# EAGLE design ml_controler (EAGLE 7.2.0)
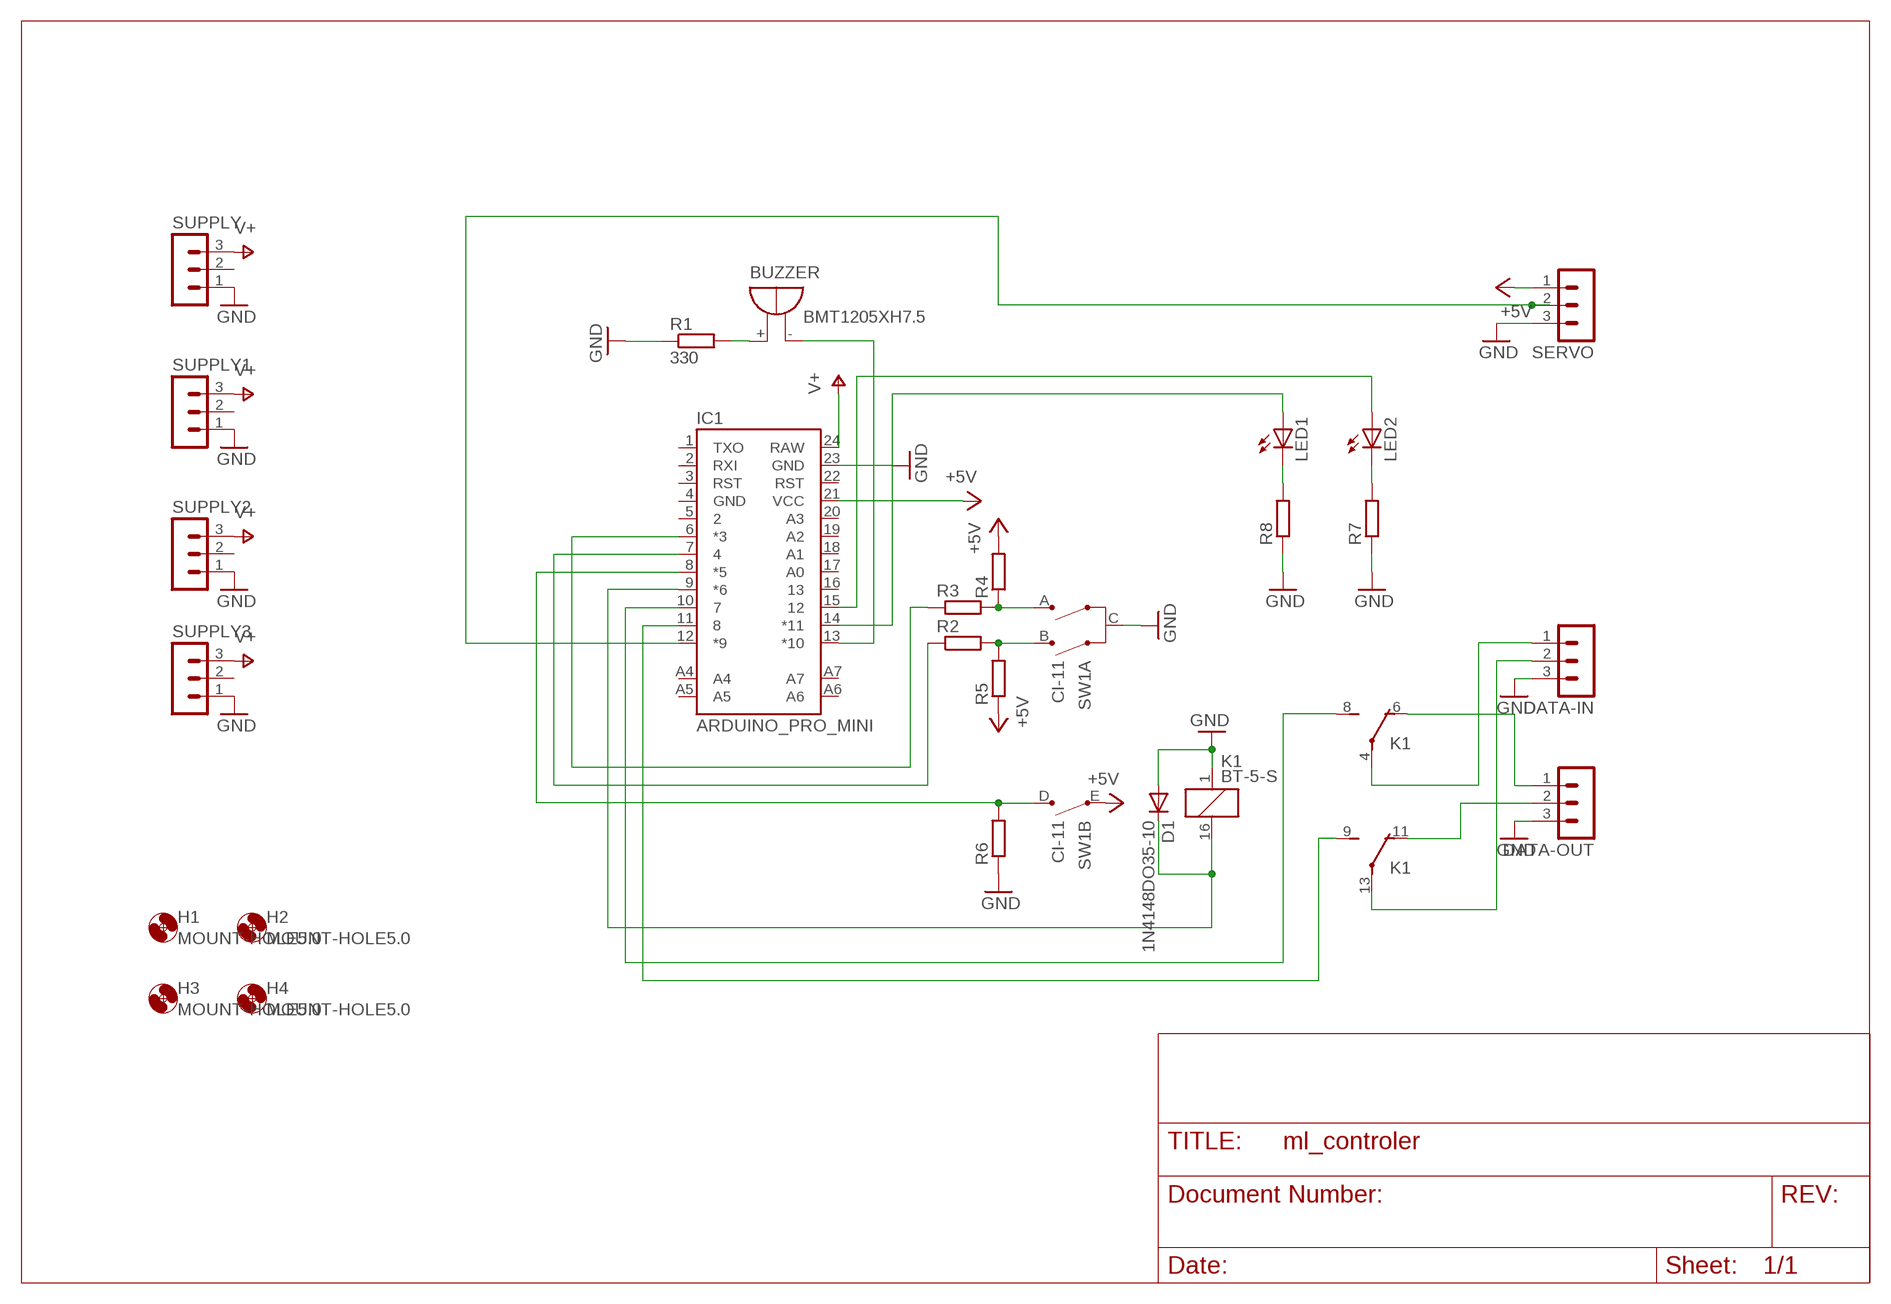
[diagram p0: schematic, sheet 1]

## Parts
BUZZER  BMT1205XH7.5  [BMT1205XH7.5]
D1  1N4148DO35-10  [DO35-10]
DATA-IN  MA03-1  [MA03-1]
DATA-OUT  MA03-1  [MA03-1]
H1  MOUNT-HOLE5.0  [5,0]
H2  MOUNT-HOLE5.0  [5,0]
H3  MOUNT-HOLE5.0  [5,0]
H4  MOUNT-HOLE5.0  [5,0]
IC1  ARDUINO_PRO_MINI  [ARDUINO_PRO_MINI]
K1  BT-5-S  [BT-XX-S]
LED1  LED5MM  [LED5MM]
LED2  LED5MM  [LED5MM]
R1  330  R-EU_0207/12  [0207/12]
R2  R-EU_0207/12  [0207/12]
R3  R-EU_0207/12  [0207/12]
R4  R-EU_0207/12  [0207/12]
R5  R-EU_0207/12  [0207/12]
R6  R-EU_0207/12  [0207/12]
R7  R-EU_0207/12  [0207/12]
R8  R-EU_0207/12  [0207/12]
SERVO  MA03-1  [MA03-1]
SUPPLY  MA03-1  [MA03-1]
SUPPLY1  MA03-1  [MA03-1]
SUPPLY2  MA03-1  [MA03-1]
SUPPLY3  MA03-1  [MA03-1]
SW1  CI-11  [CI-11]

## Nets
+5V: IC1.21(VCC) R4.2 R5.1 SERVO.1 SW1.E(B:E)
GND: D1.A DATA-IN.3 DATA-OUT.3 IC1.23(GND) K1.1 R1.1 R6.1 R7.1 R8.1 SERVO.3 SUPPLY1.1 SUPPLY2.1 SUPPLY3.1 SUPPLY.1 SW1.C(A:C)
N$1: BUZZER.- IC1.13(*10)
N$2: R3.2 R4.1 SW1.A(A:A)
N$3: R2.2 R5.2 SW1.B(A:B)
N$4: IC1.6(*3) R3.1
N$5: IC1.7 R2.1
N$6: IC1.8(*5) R6.2 SW1.D(B:D)
N$7: IC1.12(*9) SERVO.2
N$8: LED2.K(C) R7.2
N$9: LED1.K(C) R8.2
N$10: IC1.14(*11) LED1.A
N$11: IC1.15 LED2.A
N$12: D1.C IC1.9(*6) K1.16
N$13: DATA-IN.1 K1.4(-1:P)
N$14: DATA-IN.2 K1.13(-2:P)
N$15: DATA-OUT.1 K1.6(-1:O)
N$16: DATA-OUT.2 K1.11(-2:O)
N$17: IC1.10 K1.8(-1:S)
N$18: IC1.11 K1.9(-2:S)
N$19: BUZZER.+ R1.2
V+: IC1.24(RAW) SUPPLY1.3 SUPPLY2.3 SUPPLY3.3 SUPPLY.3
Unconnected: IC1.1(TXO) IC1.2(RXI) IC1.3(RST) IC1.4(GND) IC1.5 IC1.16 IC1.17(A0) IC1.18(A1) IC1.19(A2) IC1.20(A3) IC1.22(RST) IC1.A4 IC1.A5 IC1.A6 IC1.A7 SUPPLY1.2 SUPPLY2.2 SUPPLY3.2 SUPPLY.2

## Library data of the parts
BUZZER = buzzer:BMT1205XH7.5: MAGNETIC TRANSDUCER Source: Http:www.be-star.com; OC_FARNELL: unknown; OC_NEWARK: unknown
D1 = diode:1N4148: DIODE high speed (Philips)
DATA-IN DATA-OUT SERVO SUPPLY SUPPLY1-SUPPLY3 = con-lstb:MA03-1: PIN HEADER; OC_FARNELL: unknown; OC_NEWARK: unknown
H1-H4 = holes:MOUNT-HOLE: MOUNTING HOLE with drill center marker
IC1 = SparkFun-Boards:ARDUINO_PRO_MINI
K1 = relay:BT-*-S: KLEIN RELAIS WASCHDICHT 2 Wechsler Distriibutor: Conrad Electronic, Bestell Nr.: 505226-13 - 24V 505226-13 - 5V 505170-13 - 12V 505170-13 - 48V Bestar Electric Ltd. Source: http://www2.produktinfo.conrad.com/datenblaetter/500000-524999/505226-da-01-en-Kleinrelais_waschdicht_24V.pdf; OC_FARNELL: unknown; OC_NEWARK: unknown
LED1 LED2 = led:LED: LED OSRAM: - CHIPLED LG R971, LG N971, LY N971, LG Q971, LY Q971, LO R971, LY R971 LH N974, LH R974 LS Q976, LO Q976, LY Q976 LO Q996 - Hyper CHIPLED LW Q18S LB Q993, LB Q99A, LB R99A - SideLED LS A670, LO A670, LY A670, LG A670, LP A670 LB A673, LV A673, LT A673, LW A673 LH A674 LY A675 LS A676, LA A676, LO A676, LY A676, LW A676 LS A679, LY A679, LG A679 - Hyper Micro SIDELED® LS Y876, LA Y876, LO Y876, LY Y876 LT Y87S - SmartLED LW L88C, LW L88S LB L89C, LB L89S, LG L890 LS L89K, LO L89K, LY L89K LS L896, LA L896, LO L896, LY L896 - TOPLED LS T670, LO T670, LY T670, LG T670, LP T670 LSG T670, LSP T670, LSY T670, LOP T670, LYG T670 LG T671, LOG T671, LSG T671 LB T673, LV T673, LT T673, LW T673 LH T674 LS T676, LA T676, LO T676, LY T676, LB T676, LH T676, LSB T676, LW T676 LB T67C, LV T67C, LT T67C, LS T67K, LO T67K, LY T67K, LW E67C LS E67B, LA E67B, LO E67B, LY E67B, LB E67C, LV E67C, LT E67C LW T67C LS T679, LY T679, LG T679 LS T770, LO T770, LY T770, LG T770, LP T770 LB T773, LV T773, LT T773, LW T773 LH T774 LS E675, LA E675, LY E675, LS T675 LS T776, LA T776, LO T776, LY T776, LB T776 LHGB T686 LT T68C, LB T68C - Hyper Mini TOPLED® LB M676 - Mini TOPLED Santana® LG M470 LS M47K, LO M47K, LY M47K Source: http://www.osram.convergy.de LUXEON: - LUMILED® LXK2-PW12-R00, LXK2-PW12-S00, LXK2-PW14-U00, LXK2-PW14-V00 LXK2-PM12-R00, LXK2-PM12-S00, LXK2-PM14-U00 LXK2-PE12-Q00, LXK2-PE12-R00, LXK2-PE12-S00, LXK2-PE14-T00, LXK2-PE14-U00 LXK2-PB12-K00, LXK2-PB12-L00, LXK2-PB12-M00, LXK2-PB14-N00, LXK2-PB14-P00, LXK2-PB14-Q00 LXK2-PR12-L00, LXK2-PR12-M00, LXK2-PR14-Q00, LXK2-PR14-R00 LXK2-PD12-Q00, LXK2-PD12-R00, LXK2-PD12-S00 LXK2-PH12-R00, LXK2-PH12-S00 LXK2-PL12-P00, LXK2-PL12-Q00, LXK2-PL12-R00 Source: www.luxeon.com KINGBRIGHT: KA-3528ASYC Source: www.kingbright.com
R1-R8 = rcl:R-EU_: RESISTOR, European symbol
SW1 = piher:CI-11: 11mm Incemental Encoder Source: www.piher.net .. 04-CI-11v04.pdf; OC_FARNELL: unknown; OC_NEWARK: unknown

## Board
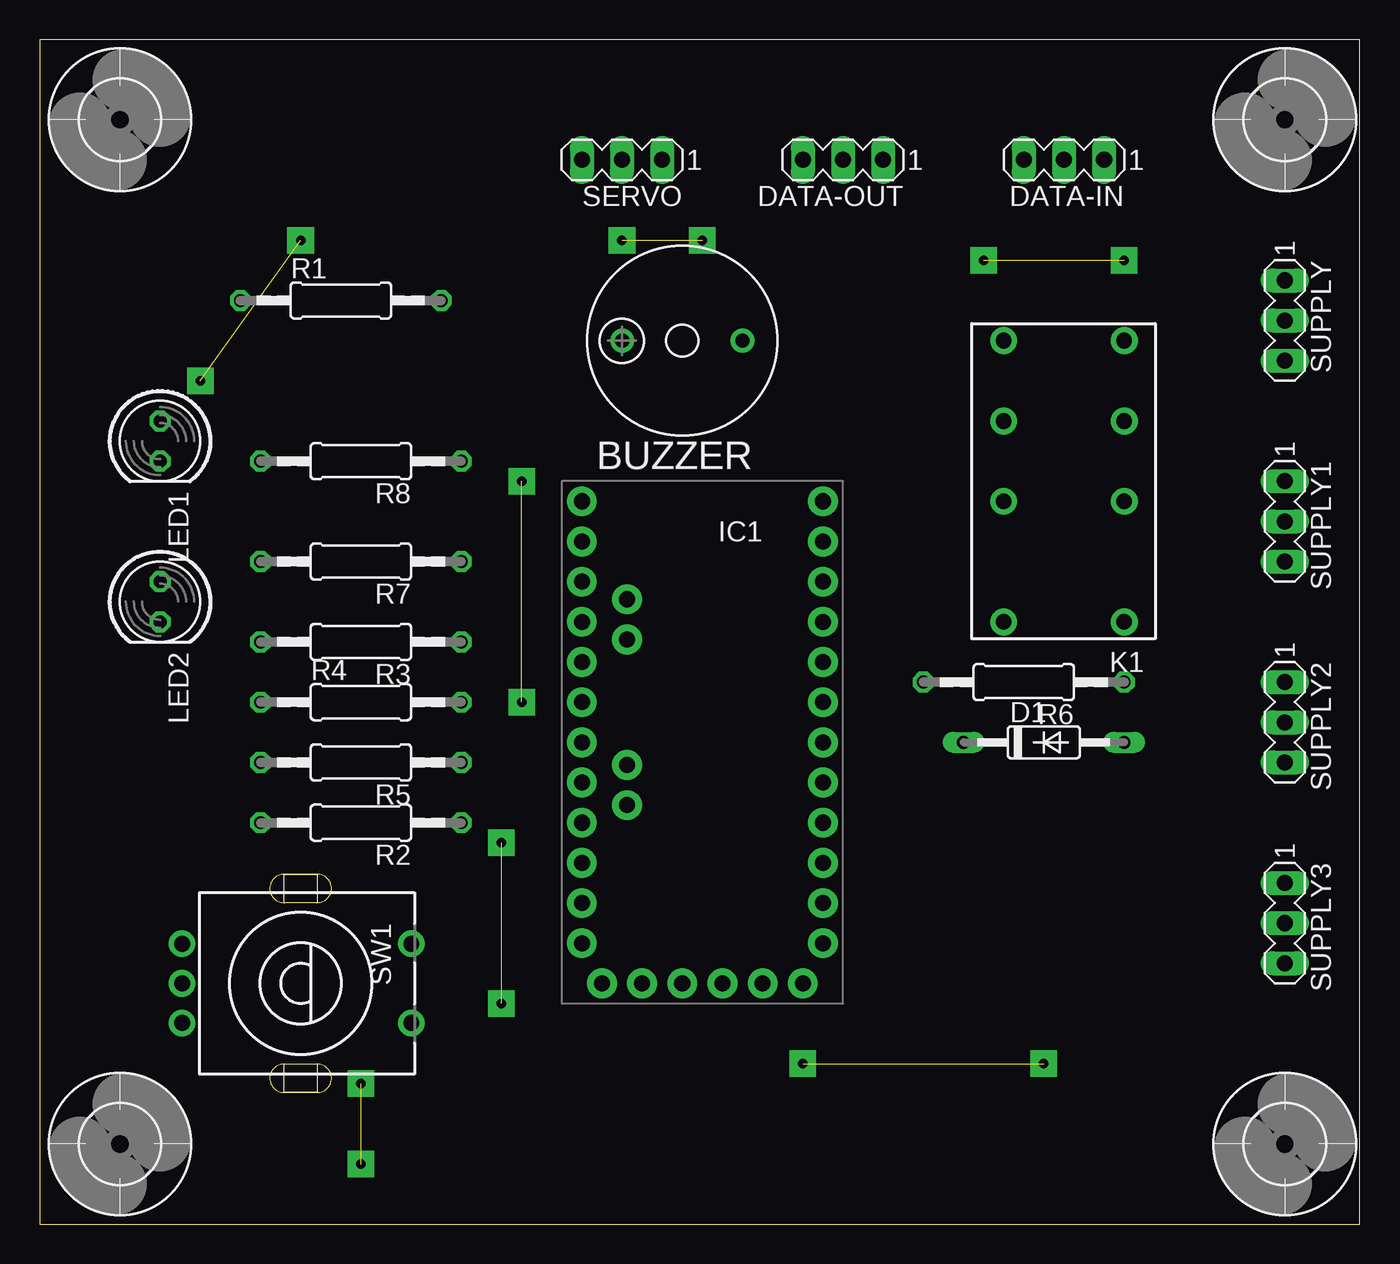
[diagram p1: board, top side]
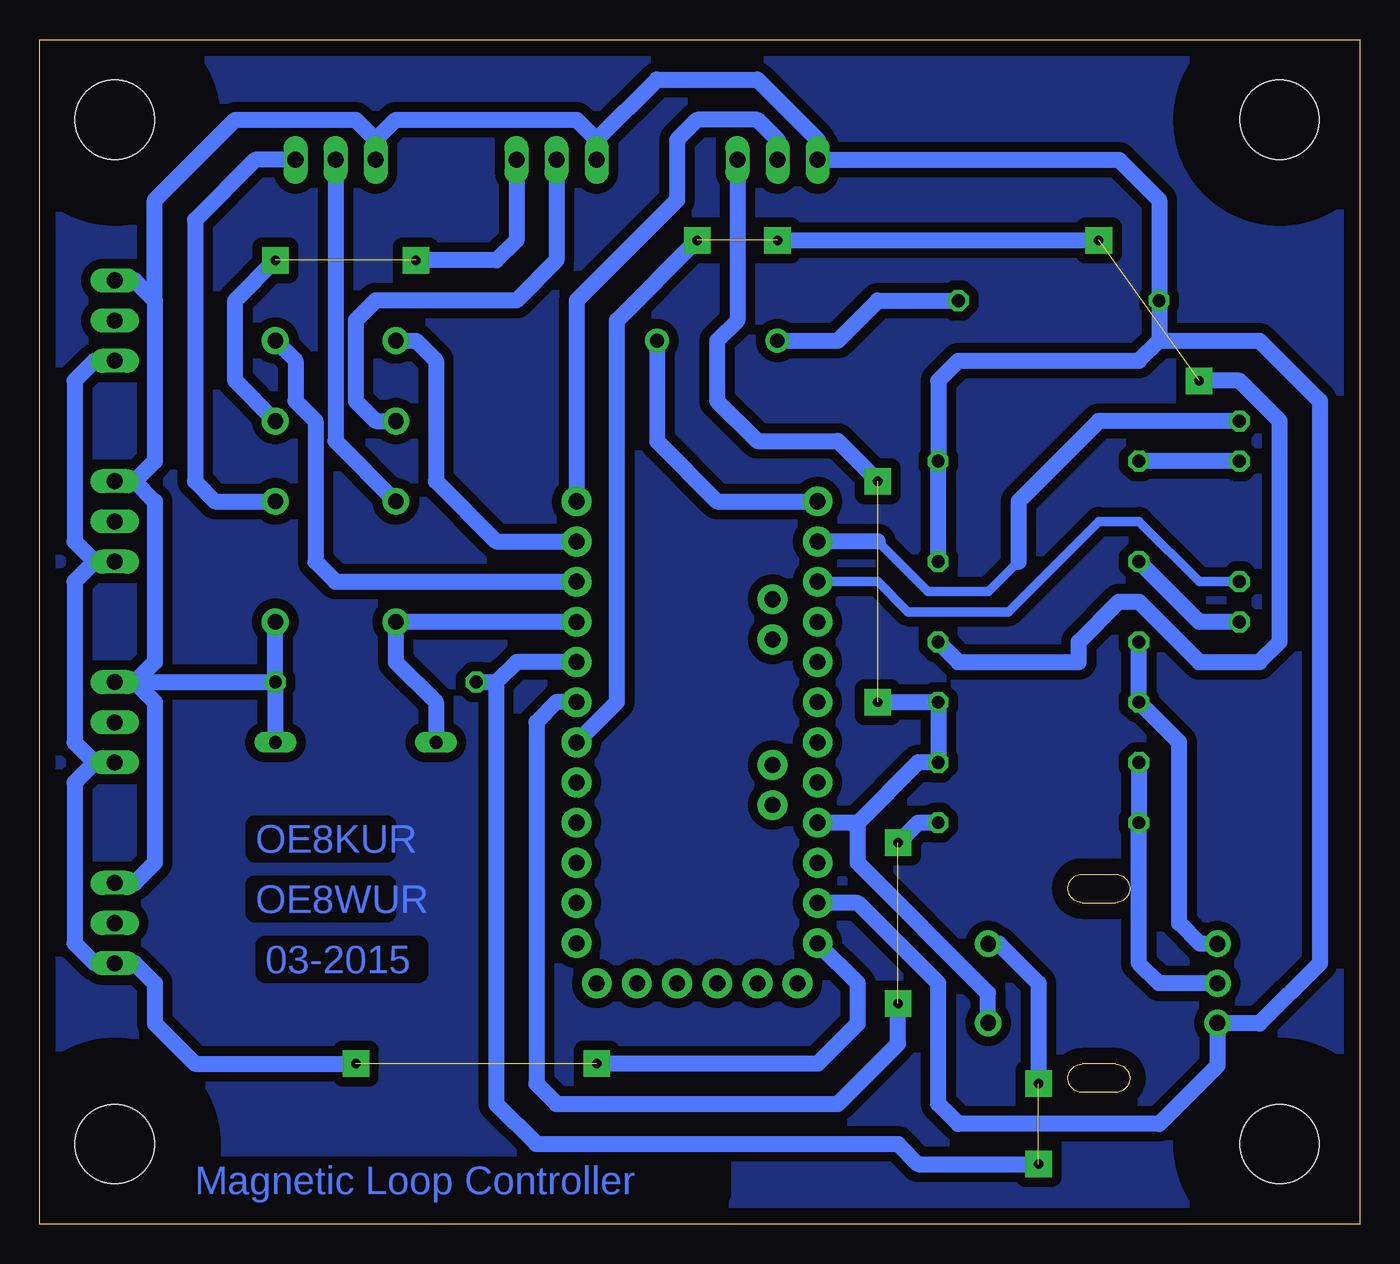
[diagram p2: board, bottom side, seen from below]

Size 83.49 x 74.92 mm. Coordinates in mm from the lower left corner, seen from the top.
Outline: 0,0 83.49,0 83.49,74.92 0,74.92 0,0
Copper layers (1*16): Top 0.035mm / dielectric 1.5mm / Bottom 0.035mm
Design rules "default": minimum track width 10mil, minimum drill 24mil, track to track 8mil, track to pad 8mil, pad to pad 8mil, via to via 8mil, smd to smd 8mil, copper to edge 40mil, drill to drill 8mil, minimum pad ring 10mil, minimum via ring 8mil, stop-mask expansion 4mil, vias tented up to drill 0mil, thermal gap 10mil

### Footprints (pad centres in the part's own frame; a part is rotated, then mirrored left to right if it is on the bottom)
BMT1205XH7.5 = drill 0.9 pad 1.5: + 3.8,0; - -3.8,0
DO35-10 = drill 0.813 long: A 5.08,0; C -5.08,0
MA03-1 = drill 1.016 long: 1 -2.54,0; 2 0,0; 3 2.54,0
5,0 = hole 5: 0,0
ARDUINO_PRO_MINI = drill 1.016 pad 1.88: 1 -7.62,12.7; 2 -7.62,10.16; 3 -7.62,7.62; 4 -7.62,5.08; 5 -7.62,2.54; 6 -7.62,0; 7 -7.62,-2.54; 8 -7.62,-5.08; 9 -7.62,-7.62; 10 -7.62,-10.16; 11 -7.62,-12.7; 12 -7.62,-15.24; 13 7.62,-15.24; 14 7.62,-12.7; 15 7.62,-10.16; 16 7.62,-7.62; 17 7.62,-5.08; 18 7.62,-2.54; 19 7.62,0; 20 7.62,2.54; 21 7.62,5.08; 22 7.62,7.62; 23 7.62,10.16; 24 7.62,12.7; A4 4.763,1.429; A5 4.763,3.969; A6 4.763,-9.049; A7 4.763,-6.509; BLK -6.35,15.24; GND -3.81,15.24; GRN 6.35,15.24; RXI 1.27,15.24; TXO 3.81,15.24; VCC -1.27,15.24
BT-XX-S = drill 1 pad 1.7: 1 -8.89,-3.81; 4 -1.27,-3.81; 6 3.81,-3.81; 8 8.89,-3.81; 9 8.89,3.81; 11 3.81,3.81; 13 -1.27,3.81; 16 -8.89,3.81
LED5MM = drill 0.813 octagon: A -1.27,0; K 1.27,0
0207/12 = drill 0.813 octagon: 1 -6.35,0; 2 6.35,0
CI-11 = drill 1 pad 1.676: A -2.5,-7.5; B 0,-7.5; C 2.5,-7.5; D -2.5,7; E 2.5,7

### Placement (x,y rotation side)
BUZZER  40.64,55.88 180 top
D1  63.5,30.48 0 top
DATA-IN  64.77,67.31 180 top
DATA-OUT  50.8,67.31 180 top
H1  5.08,69.85 0 top
H2  5.08,5.08 0 top
H3  78.74,5.08 0 top
H4  78.74,69.85 0 top
IC1  41.91,30.48 180 top
K1  64.77,46.99 90 top
LED1  7.62,49.53 270 top
LED2  7.62,39.37 270 top
R1  19.05,58.42 0 top
R2  20.32,25.4 180 top
R3  20.32,36.83 180 top
R4  20.32,33.02 0 top
R5  20.32,29.21 180 top
R6  62.23,34.29 180 top
R7  20.32,41.91 180 top
R8  20.32,48.26 180 top
SERVO  36.83,67.31 180 top
SUPPLY  78.74,57.15 270 top
SUPPLY1  78.74,44.45 270 top
SUPPLY2  78.74,31.75 270 top
SUPPLY3  78.74,19.05 270 top
SW1  16.51,15.24 270 top

### Tracks (layer width: path | path; a pad name or v marks a point on that pad's centre or on a via)
+5V  (via drill 0.6 pad 1.68)  (1 unrouted)
  Bottom 1.016: SERVO.1 39.37,57.15 40.64,55.88 40.64,52.07 38.1,49.53 33.02,49.53 v30.48,46.99 | v30.48,33.02 R4.2 R5.1 27.94,29.21 31.75,25.4 | 31.75,25.4 IC1.21 | SW1.E 23.51,14.62 31.75,22.86 31.75,25.4
GND
  Bottom 1.016: SUPPLY.1 77.47,59.69 76.2,58.42 | 76.2,58.42 76.2,48.26 77.47,46.99 | 77.47,46.99 SUPPLY1.1 | 77.47,46.99 76.2,45.72 76.2,35.56 77.47,34.29 | SUPPLY2.1 77.47,34.29 | 77.47,34.29 76.2,33.02 76.2,22.86 77.47,21.59 SUPPLY3.1 | 77.47,34.29 R6.1 | R6.1 K1.1 | R6.1 D1.A | 76.2,58.42 76.2,64.77 71.12,69.85 63.5,69.85 62.23,68.58 | 12.7,55.88 R1.1 12.7,64.77 15.24,67.31 SERVO.3 34.29,68.58 38.1,72.39 44.45,72.39 48.26,68.58 | 48.26,68.58 DATA-OUT.3 | 48.26,68.58 49.53,69.85 60.96,69.85 62.23,68.58 | 62.23,68.58 DATA-IN.3 | IC1.23 31.75,20.32 26.67,15.24 26.67,7.62 25.4,6.35 12.7,6.35 9.01,10.04 SW1.C 8.97,12.7 6.35,12.7 2.54,16.51 2.54,52.07 6.35,55.88 12.7,55.88 | R7.1 R8.1 26.67,53.34 25.4,54.61 13.97,54.61 12.7,55.88
N$1
  Bottom 1.016: BUZZER.- 44.44,49.52 40.64,45.72 IC1.13
N$2
  Bottom 1.016: SW1.A 10.12,17.74 11.43,19.05 11.43,30.48 R4.1 R3.2
N$3
  Bottom 1.016: SW1.B 12.7,15.24 13.97,16.51 R2.2 R5.2
N$4  (via drill 0.6 pad 1.68)  (2 unrouted)
  Bottom 1.016: IC1.6 46.99,33.02 46.99,57.15 v41.91,62.23 | R3.1 25.4,35.56 17.78,35.56 17.78,36.83 15.24,39.37 13.97,39.37 10.16,35.56 6.35,35.56 5.08,36.83 5.08,50.8 7.62,53.34 v10.16,53.34 | v36.83,62.23 v16.51,62.23
N$5  (via drill 0.6 pad 1.68)  (1 unrouted)
  Bottom 1.016: IC1.7 50.8,33.02 52.07,31.75 52.07,8.89 50.8,7.62 33.02,7.62 29.21,11.43 v29.21,13.97 | R2.1 27.94,25.4 v29.21,24.13
N$6  (via drill 0.6 pad 1.68)  (1 unrouted)
  Bottom 1.016: IC1.8 53.34,35.56 54.61,34.29 | R6.2 54.61,34.29 | 54.61,34.29 54.61,7.62 52.07,5.08 29.21,5.08 27.94,3.81 v20.32,3.81 | SW1.D 22.82,17.74 20.32,15.24 v20.32,8.89
N$7
  Bottom 1.016: SERVO.2 36.83,68.58 38.1,69.85 41.91,69.85 43.18,68.58 43.18,64.77 49.53,58.42 IC1.12
N$8
  Bottom 1.016: LED2.K 10.16,38.1 R7.2
N$9
  Bottom 1.016: LED1.K R8.2
N$10
  Bottom 0.61: 21.59,41.91 23.5,40.01 27.3,40.01 30.48,43.18
  Bottom 1.016: LED1.A 16.51,50.8 21.59,45.72 21.59,41.91 | 30.48,43.18 IC1.14
N$11
  Bottom 0.61: IC1.15 30.48,40.64 28.57,38.73 22.23,38.73 16.51,44.45 13.97,44.45 10.16,40.64 LED2.A
N$12
  Bottom 1.016: IC1.9 K1.16 60.96,35.56 58.42,33.02 D1.C
N$13
  Bottom 1.016: DATA-IN.1 69.85,67.31 73.66,63.5 73.66,46.99 72.39,45.72 K1.4
N$14
  Bottom 1.016: DATA-IN.2 64.77,49.53 K1.13
N$15  (via drill 0.6 pad 1.68)  (1 unrouted)
  Bottom 1.016: DATA-OUT.1 53.34,62.23 54.61,60.96 v59.69,60.96 | K1.6 71.12,53.34 71.12,58.42 v68.58,60.96
N$16
  Bottom 1.016: DATA-OUT.2 50.8,60.96 53.34,58.42 62.23,58.42 63.5,57.15 63.5,52.07 62.23,50.8 K1.11
N$17
  Bottom 1.016: K1.8 67.31,54.61 67.31,52.07 66.04,50.8 66.04,41.91 64.77,40.64 IC1.10
N$18
  Bottom 1.016: K1.9 59.69,55.88 58.42,54.61 58.42,46.99 54.61,43.18 IC1.11
N$19
  Bottom 1.016: BUZZER.+ 33.02,55.88 30.48,58.42 R1.2
N$20
  pour Bottom (isolate 0.61): 0,74.93 83.82,74.93 83.82,0 0,0
V+  (via drill 0.6 pad 1.68)  (1 unrouted)
  Bottom 1.016: SUPPLY.3 80.01,54.61 81.28,53.34 81.28,43.18 80.01,41.91 | SUPPLY1.3 80.01,41.91 | 80.01,41.91 81.28,40.64 81.28,30.48 80.01,29.21 | SUPPLY2.3 80.01,29.21 | 80.01,29.21 81.28,27.94 81.28,17.78 80.01,16.51 SUPPLY3.3 77.47,16.51 76.2,15.24 76.2,12.7 73.66,10.16 v63.5,10.16 | IC1.24 31.75,15.24 31.75,12.7 34.29,10.16 v48.26,10.16

### Text on the board
Bottom: OE8KUR | OE8WUR | 03-2015 | Magnetic Loop Controller